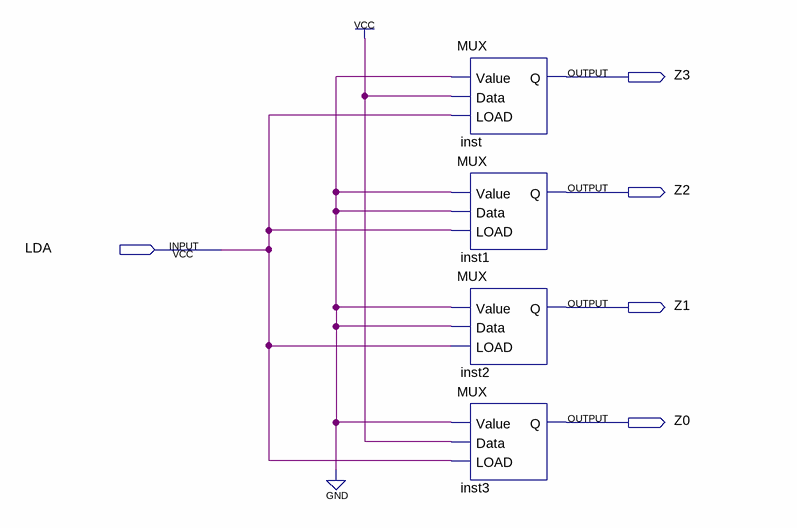
[diagram p0: schematic sheet]
// Quartus schematic Selector.bdf as structural Verilog: 4 symbols, 5 pins
module Selector (
  input  LDA,
  output Z3,
  output Z2,
  output Z1,
  output Z0
);

  MUX inst (.Value(1'b0), .Data(1'b1), .LOAD(LDA), .Q(Z3));
  MUX inst1 (.Value(1'b0), .Data(1'b0), .LOAD(LDA), .Q(Z2));
  MUX inst2 (.Value(1'b0), .Data(1'b0), .LOAD(LDA), .Q(Z1));
  MUX inst3 (.Value(1'b0), .Data(1'b1), .LOAD(LDA), .Q(Z0));
endmodule
